# EAGLE design Adafruit DS3231 RTC FeatherWing (EAGLE 6.4)
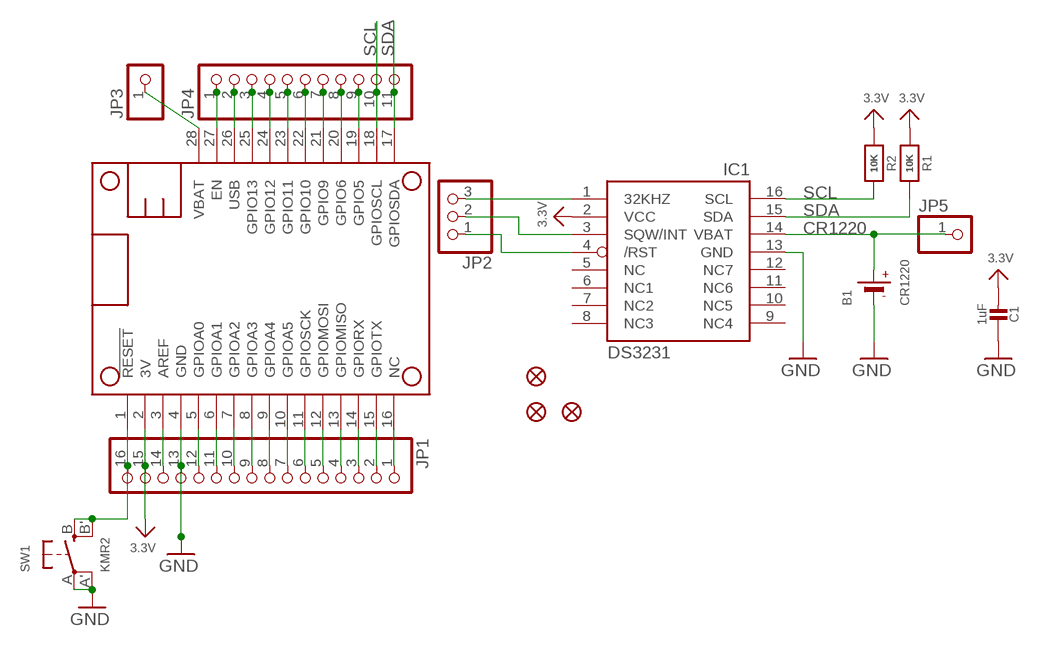
[diagram p0: schematic, sheet 1]

## Parts
B1  CR1220  BATTERYCR1220_2  [CR1220-2]
C1  1uF  CAP_CERAMIC0805-NOOUTLINE  [0805-NO]
FID1  FIDUCIAL""  [FIDUCIAL_1MM]
FID2  FIDUCIAL""  [FIDUCIAL_1MM]
FID3  FIDUCIAL""  [FIDUCIAL_1MM]
IC1  DS3231/SO  [SO16W]
JP1  HEADER-1X16ROUND  [1X16_ROUND]
JP2  HEADER-1X3ROUND  [1X03_ROUND]
JP3  HEADER-1X1ROUND  [1X01_ROUND]
JP4  HEADER-1X11  [1X11_ROUND]
JP5  HEADER-1X1ROUND  [1X01_ROUND]
MS1  MICROSHIELD_NODIM  [MICROSHIELD_DIM]
R1  10K  RESISTOR0805_NOOUTLINE  [0805-NO]
R2  10K  RESISTOR0805_NOOUTLINE  [0805-NO]
SW1  KMR2  SWITCH_TACT_SMT4.6X2.8  [BTN_KMR2_4.6X2.8]

## Nets
3.3V: C1.2 IC1.2(VCC) JP1.15 MS1.2(3V) R1.1 R2.1
32KHZ: IC1.1(32KHZ) JP2.3
!RTC_RST: IC1.4(/RST) JP2.1
CR1220: B1.+ IC1.14(VBAT) JP5.1
GND: B1.- C1.1 IC1.13(GND) JP1.13 MS1.4(GND) SW1.A'(P1) SW1.A(P)
N$2: JP1.1 MS1.16(NC)
N$3: JP1.2 MS1.15(GPIOTX)
N$4: JP1.3 MS1.14(GPIORX)
N$5: JP1.4 MS1.13(GPIOMISO)
N$6: JP1.5 MS1.12(GPIOMOSI)
N$7: JP1.6 MS1.11(GPIOSCK)
N$8: JP1.7 MS1.10(GPIOA5)
N$9: JP1.8 MS1.9(GPIOA4)
N$10: JP1.9 MS1.8(GPIOA3)
N$11: JP1.10 MS1.7(GPIOA2)
N$12: JP1.11 MS1.6(GPIOA1)
N$13: JP1.12 MS1.5(GPIOA0)
N$14: JP4.1 MS1.27(EN)
N$15: JP4.3 MS1.25(GPIO13)
N$16: JP4.4 MS1.24(GPIO12)
N$17: JP4.5 MS1.23(GPIO11)
N$18: JP4.6 MS1.22(GPIO10)
N$19: JP4.7 MS1.21(GPIO9)
N$20: JP4.8 MS1.20(GPIO6)
N$21: JP4.9 MS1.19(GPIO5)
N$23: JP1.14 MS1.3(AREF)
N$25: JP1.16 MS1.1(!RESET) SW1.B'(S1) SW1.B(S)
SCL: IC1.16(SCL) JP4.10 MS1.18(GPIOSCL) R2.2
SDA: IC1.15(SDA) JP4.11 MS1.17(GPIOSDA) R1.2
SQW: IC1.3(SQW/INT) JP2.2
USB: JP4.2 MS1.26(USB)
VBAT: JP3.1 MS1.28(VBAT)
Unconnected: IC1.5(NC) IC1.6(NC1) IC1.7(NC2) IC1.8(NC3) IC1.9(NC4) IC1.10(NC5) IC1.11(NC6) IC1.12(NC7)

## Library data of the parts
B1 = microbuilder:BATTERY: CR1220 SMT - Digikey: 3001K-ND CD2032 BAT-HLD-001 - Digikey: BAT-HLD-001-ND
C1 = microbuilder:CAP_CERAMIC: Ceramic Capacitors For new designs, use the packages preceded by an '_' character since they are more reliable: The following footprints should be used on most boards: _0402 - Standard footprint for regular board layouts _0603 - Standard footprint for regular board layouts _0805 - Standard footprint for regular board layouts _1206 - Standard footprint for regular board layouts For extremely tight-pitch boards where space is at a premium, the following 'micro-pitch' footprints can be used (smaller pads, no silkscreen outline, etc.): _0402MP - Micro-pitch footprint for very dense/compact boards _0603MP - Micro-pitch footprint for very dense/compact boards _0805MP - Micro-pitch footprint for very dense/compact boards _1206MP - Micro-pitch footprint for very dense/compact boards
FID1-FID3 = microbuilder:FIDUCIAL: Fiducial Alignment Points Various fiducial points for machine vision alignment.; BOM: EXCLUDE
IC1 = adafruit:DS3231
JP1 = microbuilder:HEADER-1X16: PIN HEADER
JP2 = microbuilder:HEADER-1X3: PIN HEADER
JP3 JP5 = microbuilder:HEADER-1X1: PIN HEADER
JP4 = microbuilder:HEADER-1X11
MS1 = microbuilder:MICROSHIELD
R1 R2 = microbuilder:RESISTOR: Resistors For new designs, use the packages preceded by an '_' character since they are more reliable: The following footprints should be used on most boards: _0402 - Standard footprint for regular board layouts _0603 - Standard footprint for regular board layouts _0805 - Standard footprint for regular board layouts _1206 - Standard footprint for regular board layouts For extremely tight-pitch boards where space is at a premium, the following 'micro-pitch' footprints can be used (smaller pads, no silkscreen outline, etc.): _0402MP - Micro-pitch footprint for very dense/compact boards _0603MP - Micro-pitch footprint for very dense/compact boards _0805MP - Micro-pitch footprint for very dense/compact boards _1206MP - Micro-pitch footprint for very dense/compact boards
SW1 = microbuilder:SWITCH_TACT_SMT: SMT Tact Switches 6x6mm - Digikey: P12940SCT-ND KMR2 (4.6x2.8mm) - Digikey: 401-1426-1-ND EVQ-PQHB55 - Light Touch, 160GF (4.5x4.5mm) - Digikey: P8090SCT-ND KMT0 - KMT021 NGJ LHS (etc.) IP68/Waterproof - Digikey: CKN10289CT-ND

## Board
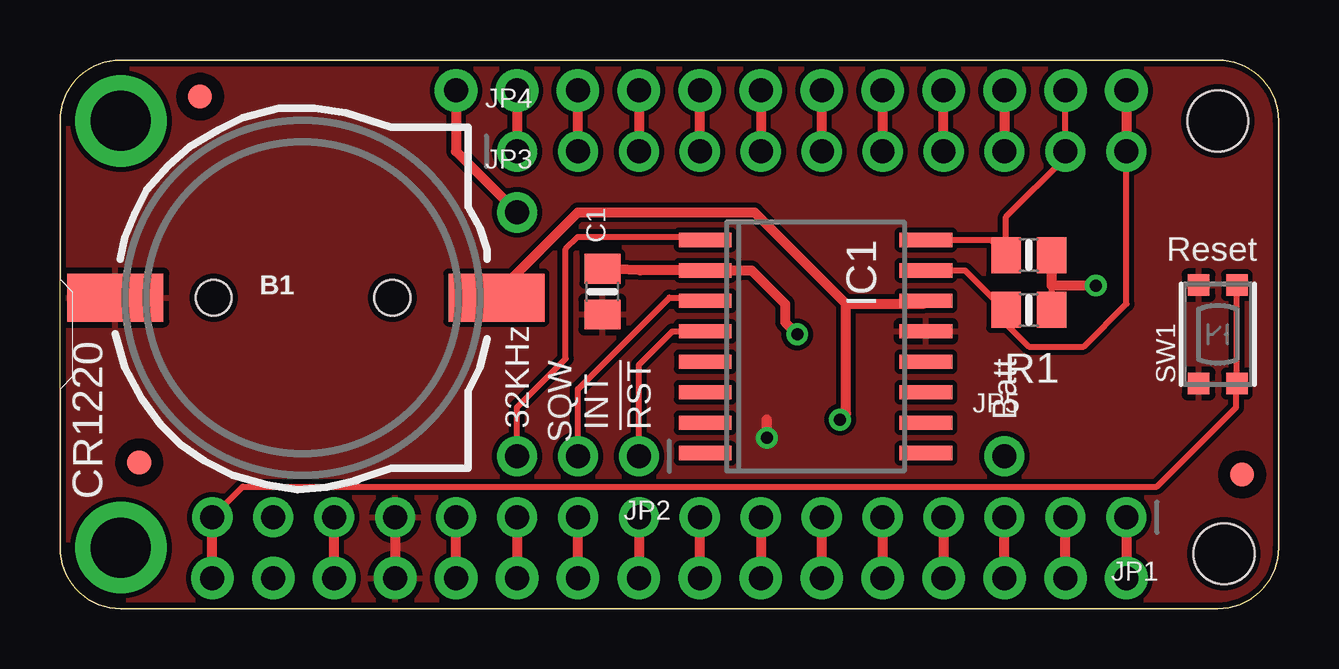
[diagram p1: board, top side]
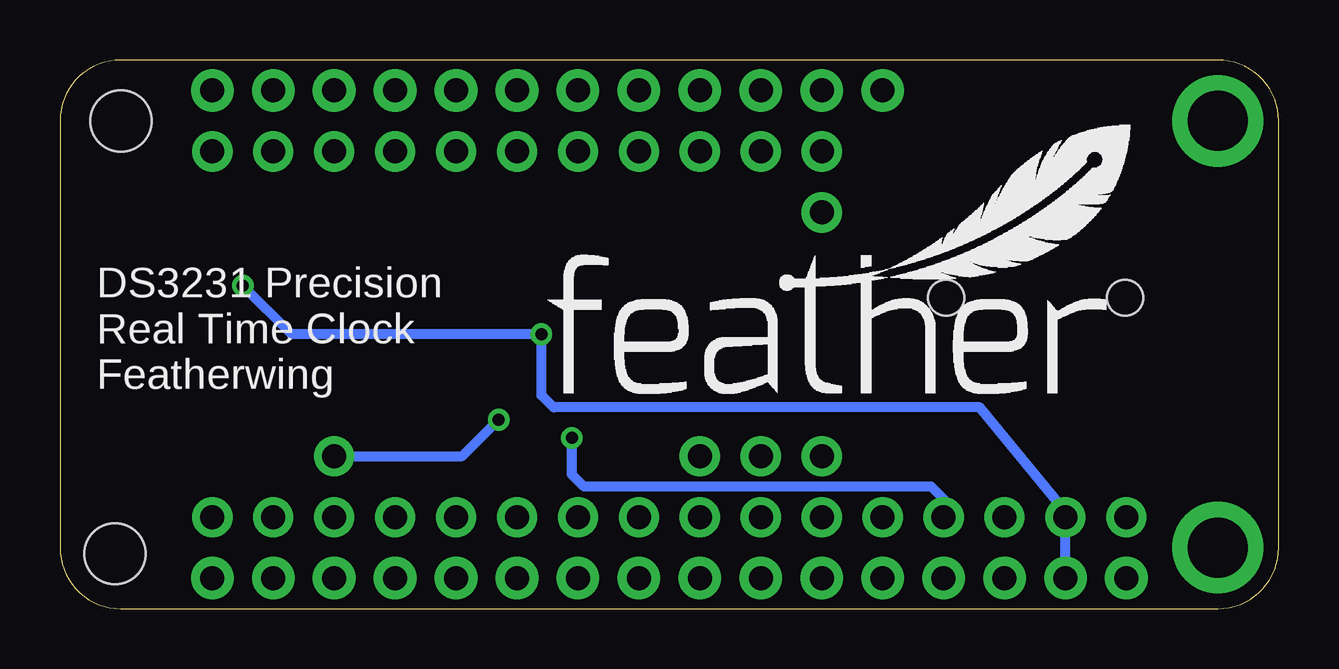
[diagram p2: board, bottom side, seen from below]

Size 50.8 x 22.86 mm. Coordinates in mm from the lower left corner, seen from the top.
Outline: 48.26,0 2.54,0 arc-90 0,2.54 0,20.32 arc-90 2.54,22.86 48.26,22.86 arc-90 50.8,20.32 50.8,2.54 arc-90 48.26,0
Copper layers (1*16): Top 0.035mm / dielectric 1.5mm / Bottom 0.035mm
Design rules "adafruit": minimum track width 8mil, minimum drill 15.5mil, track to track 8mil, track to pad 8mil, pad to pad 8mil, via to via 8mil, smd to smd 8mil, copper to edge 10mil, drill to drill 8mil, minimum pad ring 10mil, minimum via ring 8mil, stop-mask expansion 2mil, vias tented up to drill 20mil, thermal gap 10mil

### Footprints (pad centres in the part's own frame; a part is rotated, then mirrored left to right if it is on the bottom)
CR1220-2 = smd 4 x 2: + 8.29,0; - -7.6,0 | hole 1.5: 3.95,0; -3.5,0
0805-NO = smd 1.24 x 1.5: 1 -0.95,0; 2 0.95,0
FIDUCIAL_1MM = smd 1 x 1: 1 0,0
SO16W = smd 0.6 x 2.2: 1 -4.445,-4.6; 2 -3.175,-4.6; 3 -1.905,-4.6; 4 -0.635,-4.6; 5 0.635,-4.6; 6 1.905,-4.6; 7 3.175,-4.6; 8 4.445,-4.6; 9 4.445,4.6; 10 3.175,4.6; 11 1.905,4.6; 12 0.635,4.6; 13 -0.635,4.6; 14 -1.905,4.6; 15 -3.175,4.6; 16 -4.445,4.6
1X16_ROUND = drill 1 pad 1.676: 1 -19.05,0; 2 -16.51,0; 3 -13.97,0; 4 -11.43,0; 5 -8.89,0; 6 -6.35,0; 7 -3.81,0; 8 -1.27,0; 9 1.27,0; 10 3.81,0; 11 6.35,0; 12 8.89,0; 13 11.43,0; 14 13.97,0; 15 16.51,0; 16 19.05,0
1X03_ROUND = drill 1 pad 1.676: 1 -2.54,0; 2 0,0; 3 2.54,0
1X01_ROUND = drill 1 pad 1.676: 1 0,0
1X11_ROUND = drill 1 pad 1.676: 1 -12.7,0; 2 -10.16,0; 3 -7.62,0; 4 -5.08,0; 5 -2.54,0; 6 0,0; 7 2.54,0; 8 5.08,0; 9 7.62,0; 10 10.16,0; 11 12.7,0
MICROSHIELD_DIM = drill 1 pad 1.778: 1 6.35,1.27; 2 8.89,1.27; 3 11.43,1.27; 4 13.97,1.27; 5 16.51,1.27; 6 19.05,1.27; 7 21.59,1.27; 8 24.13,1.27; 9 26.67,1.27; 10 29.21,1.27; 11 31.75,1.27; 12 34.29,1.27; 13 36.83,1.27; 14 39.37,1.27; 15 41.91,1.27; 16 44.45,1.27; 17 44.45,21.59; 18 41.91,21.59; 19 39.37,21.59; 20 36.83,21.59; 21 34.29,21.59; 22 31.75,21.59; 23 29.21,21.59; 24 26.67,21.59; 25 24.13,21.59; 26 21.59,21.59; 27 19.05,21.59; 28 16.51,21.59 | drill 2.5 pad 3.81: P$1 2.54,20.32; P$2 2.54,2.54 | hole 2.54: 48.26,20.32; 48.514,2.286
BTN_KMR2_4.6X2.8 = smd 0.9 x 0.9: A 2.05,0.8; A' -2.05,0.8; B 2.05,-0.8; B' -2.05,-0.8

### Placement (x,y rotation side)
B1  9.91,12.95 0 top
C1  22.61,13.21 90 top
FID1  3.3,6.1 0 top
FID2  5.84,21.34 0 top
FID3  49.28,5.59 0 top
IC1  31.5,10.92 270 top
JP1  25.4,3.81 180 top
JP2  21.59,6.35 180 top
JP3  19.05,16.51 0 top
JP4  31.75,19.05 0 top
JP5  39.37,6.35 0 top
MS1  0,0 0 top
R1  40.39,12.45 180 top
R2  40.39,14.73 180 top
SW1  48.26,11.43 90 top
U$6  [FEATHERLOGO]  30.48,8.89 0 bottom

### Tracks (layer width: path | path; a pad name or v marks a point on that pad's centre or on a via)
3.3V  (via drill 0.5)
  Top 0.254: R1.1 R2.1
  Top 0.406: v30.73,11.43 30.23,11.94 30.23,12.7 28.83,14.1 IC1.2 24.19,14.1 C1.2 | v43.18,13.46 41.34,13.46 R2.1
  Bottom 0.406: v43.18,13.46 41.15,11.43 v30.73,11.43 30.73,8.89 30.23,8.38 12.45,8.38 8.89,4.06 JP1.15 MS1.2
32KHZ
  Top 0.254: JP2.3 19.05,8.38 21.08,10.41 21.08,14.99 21.59,15.49 26.77,15.49 IC1.1
!RTC_RST
  Top 0.254: JP2.1 24.13,10.16 25.53,11.56 IC1.4
CR1220  (via drill 0.5)
  Top 0.406: 32.77,12.7 35.97,12.7 IC1.14 | B1.+ 18.7,13.62 21.59,16.51 28.96,16.51 32.77,12.7 | v32.51,7.87 32.77,8.13 32.77,12.7
  Bottom 0.406: JP5.1 34.04,6.35 v32.51,7.87
GND  (via drill 0.5)
  Top 0.406: JP1.13 MS1.4 | v29.46,7.11 29.46,7.87
  Bottom 0.406: JP1.13 13.97,4.57 14.48,5.08 28.96,5.08 29.46,5.59 v29.46,7.11
  pour Top: 0,22.86 0,0 50.8,0 50.8,22.86
N$2
  Top 0.406: JP1.1 MS1.16
N$3
  Top 0.406: MS1.15 JP1.2
N$4
  Top 0.406: MS1.14 JP1.3
N$5
  Top 0.406: JP1.4 MS1.13
N$6
  Top 0.406: JP1.5 MS1.12
N$7
  Top 0.406: MS1.11 JP1.6
N$8
  Top 0.406: JP1.7 MS1.10
N$9
  Top 0.406: MS1.9 JP1.8
N$10
  Top 0.406: JP1.9 MS1.8
N$11
  Top 0.406: MS1.7 JP1.10
N$12
  Top 0.406: JP1.11 MS1.6
N$13
  Top 0.406: MS1.5 JP1.12
N$14
  Top 0.406: MS1.27 JP4.1
N$15
  Top 0.406: MS1.25 JP4.3
N$16
  Top 0.406: JP4.4 MS1.24
N$17
  Top 0.406: MS1.23 JP4.5
N$18
  Top 0.406: JP4.6 MS1.22
N$19
  Top 0.406: MS1.21 JP4.7
N$20
  Top 0.406: JP4.8 MS1.20
N$21
  Top 0.406: MS1.19 JP4.9
N$23
  Top 0.406: MS1.3 JP1.14
N$25
  Top 0.254: JP1.16 7.62,5.08 45.72,5.08 49.02,8.38 49.02,9.34 SW1.B' SW1.B
  Top 0.406: MS1.1 JP1.16
SCL
  Top 0.254: IC1.16 38.8,15.37 R2.2 39.44,16.32 41.91,18.8 JP4.10 MS1.18
SDA
  Top 0.254: IC1.15 37.72,14.1 39.37,12.45 R1.2 39.44,11.87 40.39,10.92 42.67,10.92 44.45,12.7 JP4.11
  Top 0.406: MS1.17 JP4.11
SQW
  Top 0.254: JP2.2 21.59,9.14 25.4,12.95 26.77,12.95 IC1.3
USB
  Top 0.406: JP4.2 MS1.26
VBAT
  Top 0.406: MS1.28 16.51,19.05 JP3.1

### Text on the board
tPlace: Reset | 32KHz | SQW / INT | !RST | Batt | CR1220
bPlace: DS3231 Precision / Real Time Clock / Featherwing